# EAGLE schematic main (EAGLE 6.1)
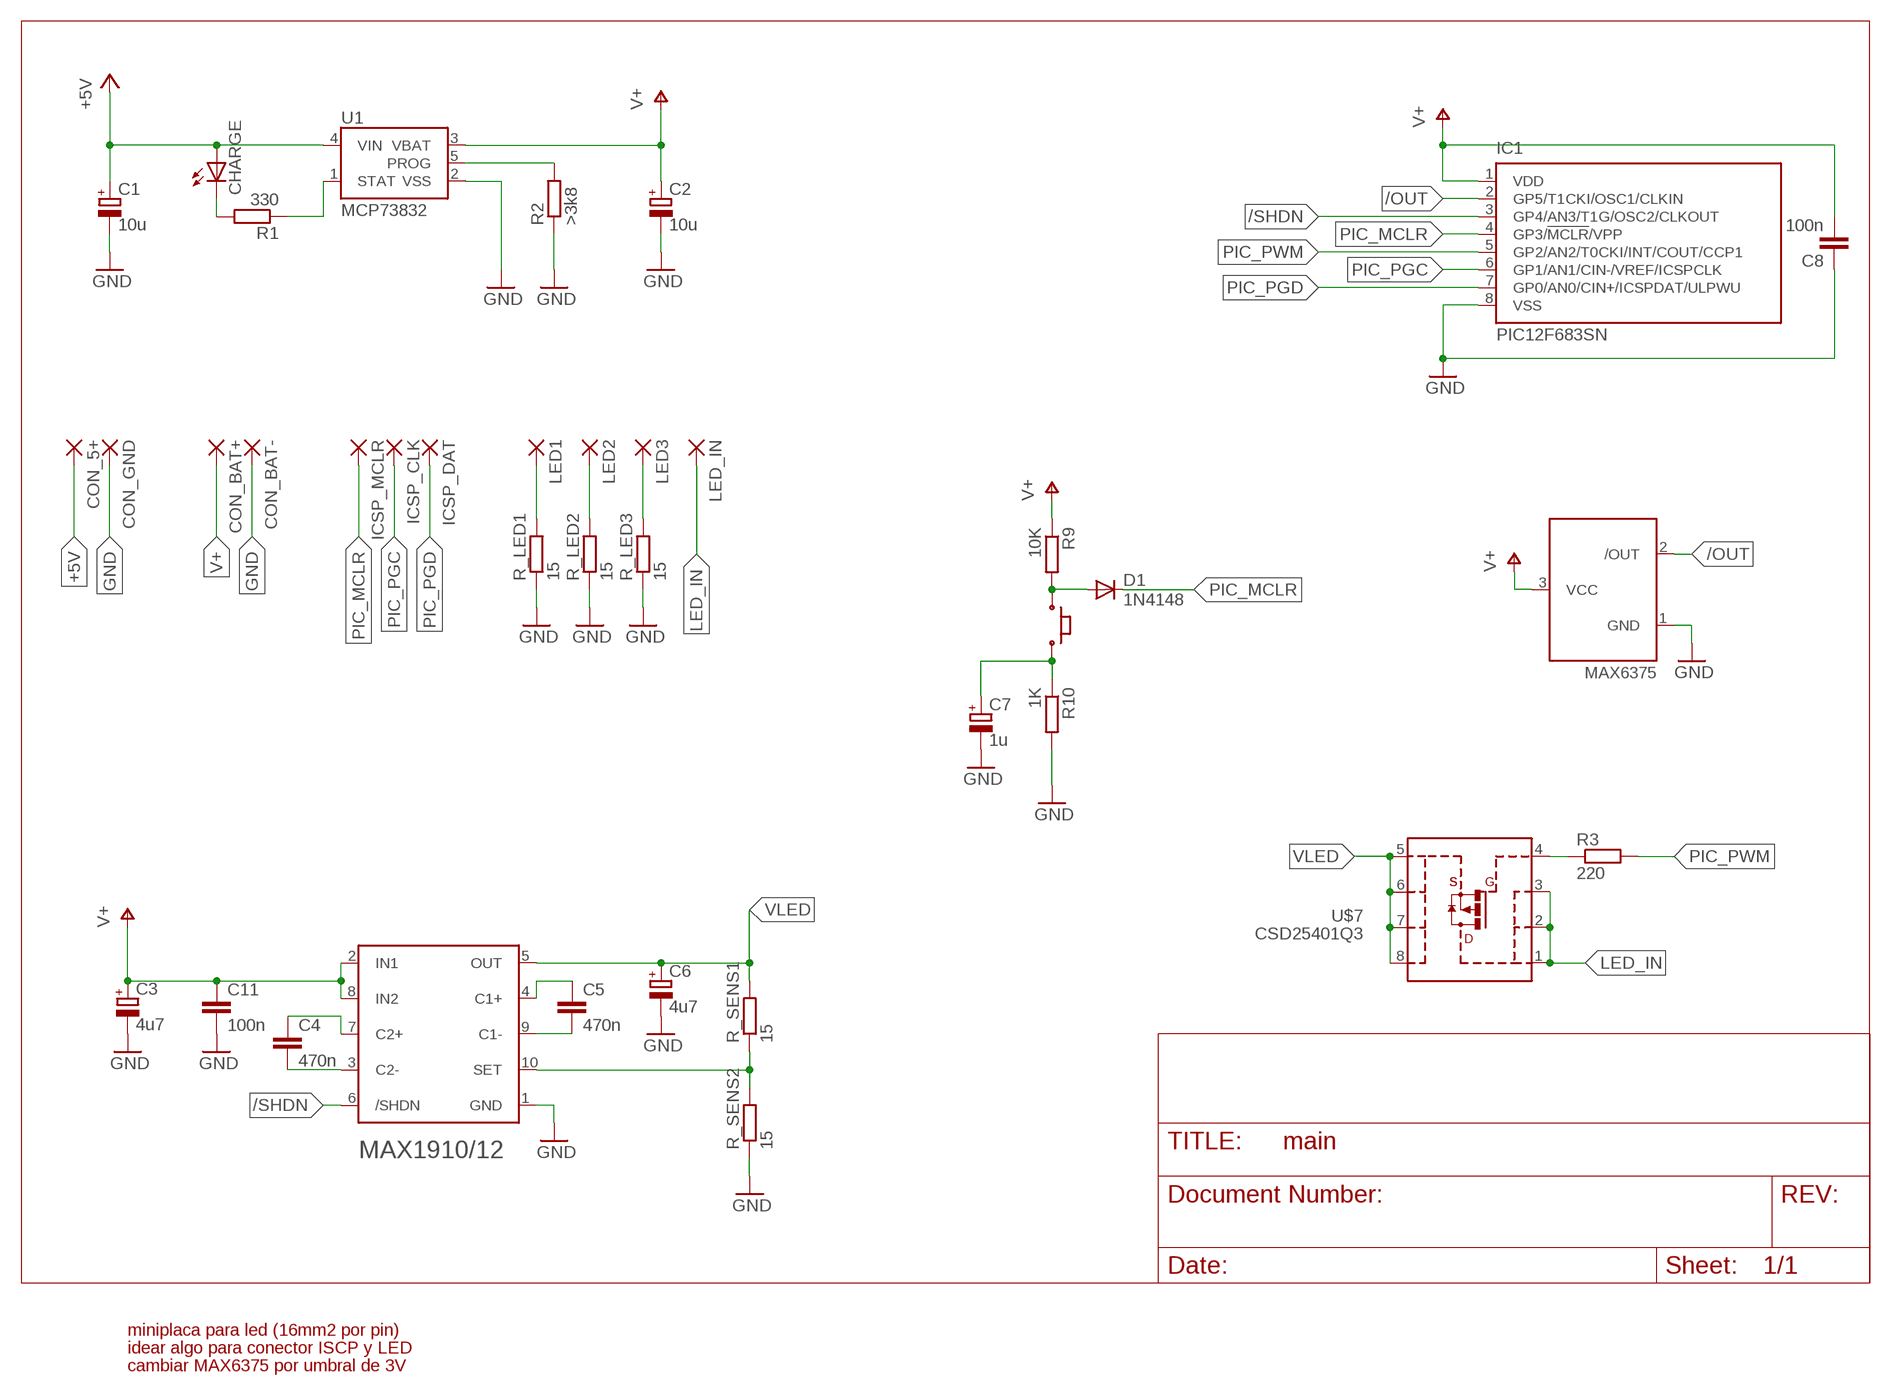
[diagram p0: schematic, sheet 1]

## Parts
C1  10u  CPOL-EUSMCA  [SMC_A]
C2  10u  CPOL-EUSMCA  [SMC_A]
C3  4u7  CPOL-EUSMCA  [SMC_A]
C4  470n  C-EUC1206  [C1206]
C5  470n  C-EUC1206  [C1206]
C6  4u7  CPOL-EUSMCA  [SMC_A]
C7  1u  CPOL-EUSMCA  [SMC_A]
C8  100n  C-EUC1206  [C1206]
C11  100n  C-EUC1206  [C1206]
CHARGE  LEDCHIPLED_1206  [CHIPLED_1206]
CON_5+  SMD5  [SMD2,54-5,08]
CON_BAT+  SMD5  [SMD2,54-5,08]
CON_BAT-  SMD5  [SMD2,54-5,08]
CON_GND  SMD5  [SMD2,54-5,08]
D1  1N4148  [SOD80]
IC1  PIC12F683SN  [SO-08]
ICSP_CLK  SMD5  [SMD2,54-5,08]
ICSP_DAT  SMD5  [SMD2,54-5,08]
ICSP_MCLR  SMD5  [SMD2,54-5,08]
LED1  SMD5  [SMD2,54-5,08]
LED2  SMD5  [SMD2,54-5,08]
LED3  SMD5  [SMD2,54-5,08]
LED_IN  SMD5  [SMD2,54-5,08]
R1  330  R-EU_R1206  [R1206]
R2  >3k8  R-EU_R1206  [R1206]
R3  220  R-EU_R1206  [R1206]
R9  10K  R-EU_R1206  [R1206]
R10  1K  R-EU_R1206  [R1206]
R_LED1  15  R-EU_R1206  [R1206]
R_LED2  15  R-EU_R1206  [R1206]
R_LED3  15  R-EU_R1206  [R1206]
R_SENS1  15  R-EU_R1206  [R1206]
R_SENS2  15  R-EU_R1206  [R1206]
U1  MCP73832  [SOT23-5]
U$1  MAX1910/12  [UMAX/USOP_10L]
U$2  MAX6375  [SC70-3-W]
U$6  MICROBUTTONE-MERCHAN  [MICROBUTTON_2]
U$7  CSD25401Q3  [SON3X3]

## Nets
+5V: C1.+ CHARGE.A CON_5+.1(P) U1.4(VIN)
/OUT: IC1.2(GP5/T1CKI/OSC1/CLKIN) U$2.2(/OUT)
/SHDN: IC1.3(GP4/AN3/T1G/OSC2/CLKOUT) U$1.6(/SHDN)
BUT: D1.1(A) R9.2 U$6.P$1
GND: C1.- C2.- C3.- C6.- C7.- C8.1 C11.2 CON_BAT-.1(P) CON_GND.1(P) IC1.8(VSS) R2.1 R10.2 R_LED1.1 R_LED2.1 R_LED3.1 R_SENS2.1 U1.2(VSS) U$1.1(GND) U$2.1(GND)
LED_IN: LED_IN.1(P) U$7.1(D$1) U$7.2(D$2) U$7.3(D$3)
N$1: C7.+ R10.1 U$6.P$2
N$2: R_SENS1.1 R_SENS2.2 U$1.10(SET)
N$3: R2.2 U1.5(PROG)
N$4: R1.1 U1.1(STAT)
N$5: C4.2 U$1.3(C2-)
N$6: C4.1 U$1.7(C2+)
N$7: C5.2 U$1.9(C1-)
N$8: C5.1 U$1.4(C1+)
N$10: LED3.1(P) R_LED3.2
N$11: LED2.1(P) R_LED2.2
N$12: LED1.1(P) R_LED1.2
N$13: R3.1 U$7.4(G$4)
N$15: CHARGE.C R1.2
PIC_MCLR: D1.2(C) IC1.4(GP3/!MCLR!/VPP) ICSP_MCLR.1(P)
PIC_PGC: IC1.6(GP1/AN1/CIN-/VREF/ICSPCLK) ICSP_CLK.1(P)
PIC_PGD: IC1.7(GP0/AN0/CIN+/ICSPDAT/ULPWU) ICSP_DAT.1(P)
PIC_PWM: IC1.5(GP2/AN2/T0CKI/INT/COUT/CCP1) R3.2
V+: C2.+ C3.+ C8.2 C11.1 CON_BAT+.1(P) IC1.1(VDD) R9.1 U1.3(VBAT) U$1.2(IN1) U$1.8(IN2) U$2.3(VCC)
VLED: C6.+ R_SENS1.2 U$1.5(OUT) U$7.5(S$5) U$7.6(S$6) U$7.7(S$7) U$7.8(S$8)

## Notes on the sheet
- miniplaca para led (16mm2 por pin)
- idear algo para conector ISCP y LED
- cambiar MAX6375 por umbral de 3V

## Library data of the parts
C1-C3 C6 C7 = rcl:CPOL-EU: POLARIZED CAPACITOR, European symbol
C4 C5 C8 C11 = rcl:C-EU: CAPACITOR, European symbol
CHARGE = led:LED: LED OSRAM: - CHIPLED LG R971, LG N971, LY N971, LG Q971, LY Q971, LO R971, LY R971 LH N974, LH R974 LS Q976, LO Q976, LY Q976 LO Q996 - Hyper CHIPLED LW Q18S LB Q993, LB Q99A, LB R99A - SideLED LS A670, LO A670, LY A670, LG A670, LP A670 LB A673, LV A673, LT A673, LW A673 LH A674 LY A675 LS A676, LA A676, LO A676, LY A676, LW A676 LS A679, LY A679, LG A679 - Hyper Micro SIDELED® LS Y876, LA Y876, LO Y876, LY Y876 LT Y87S - SmartLED LW L88C, LW L88S LB L89C, LB L89S, LG L890 LS L89K, LO L89K, LY L89K LS L896, LA L896, LO L896, LY L896 - TOPLED LS T670, LO T670, LY T670, LG T670, LP T670 LSG T670, LSP T670, LSY T670, LOP T670, LYG T670 LG T671, LOG T671, LSG T671 LB T673, LV T673, LT T673, LW T673 LH T674 LS T676, LA T676, LO T676, LY T676, LB T676, LH T676, LSB T676, LW T676 LB T67C, LV T67C, LT T67C, LS T67K, LO T67K, LY T67K, LW E67C LS E67B, LA E67B, LO E67B, LY E67B, LB E67C, LV E67C, LT E67C LW T67C LS T679, LY T679, LG T679 LS T770, LO T770, LY T770, LG T770, LP T770 LB T773, LV T773, LT T773, LW T773 LH T774 LS E675, LA E675, LY E675, LS T675 LS T776, LA T776, LO T776, LY T776, LB T776 LHGB T686 LT T68C, LB T68C - Hyper Mini TOPLED® LB M676 - Mini TOPLED Santana® LG M470 LS M47K, LO M47K, LY M47K Source: http://www.osram.convergy.de LUXEON: - LUMILED® LXK2-PW12-R00, LXK2-PW12-S00, LXK2-PW14-U00, LXK2-PW14-V00 LXK2-PM12-R00, LXK2-PM12-S00, LXK2-PM14-U00 LXK2-PE12-Q00, LXK2-PE12-R00, LXK2-PE12-S00, LXK2-PE14-T00, LXK2-PE14-U00 LXK2-PB12-K00, LXK2-PB12-L00, LXK2-PB12-M00, LXK2-PB14-N00, LXK2-PB14-P00, LXK2-PB14-Q00 LXK2-PR12-L00, LXK2-PR12-M00, LXK2-PR14-Q00, LXK2-PR14-R00 LXK2-PD12-Q00, LXK2-PD12-R00, LXK2-PD12-S00 LXK2-PH12-R00, LXK2-PH12-S00 LXK2-PL12-P00, LXK2-PL12-Q00, LXK2-PL12-R00 Source: www.luxeon.com KINGBRIGHT: KA-3528ASYC Source: www.kingbright.com
CON_5+ CON_BAT+ CON_BAT- CON_GND ICSP_CLK ICSP_DAT ICSP_MCLR LED1-LED3 LED_IN = wirepad:SMD5: SMD PAD
D1 = dan:1N4148: DIODE high speed (Philips)
IC1 = microchip:PIC12F683: 8-Pin Flash-Based, 8-Bit CMOS Microcontrollers with nanoWatt Technology Source: http://ww1.microchip.com/downloads/en/DeviceDoc/41211D_.pdf; MF: MICROCHIP; MPN: PIC12F683-I/SN; OC_FARNELL: 9759042; OC_NEWARK: 61K3434
R1-R3 R9 R10 R_LED1-R_LED3 R_SENS1 R_SENS2 = rcl:R-EU_: RESISTOR, European symbol
U1 = dan:MCP73832: Microchip's MCP73832 Miniature single cell, fully integrated Li-Ion, Li-polymer charge management controller http://ww1.microchip.com/downloads/en/DeviceDoc/21984a.pdf
U$1 = dan:MAX1910/12: MAX1910/12 1.5X/2X High-Efficiency White LED Charge Pumps
U$2 = dan:MAX6375: MAX6375 3 pin, ultra-low-power sc70/sot23 voltage detectors
U$6 = dan:MICROBUTTON
U$7 = dan:CSD25401Q3